# Altium schematic sheet HDMI.SchDoc: HDMI Interface
size A4
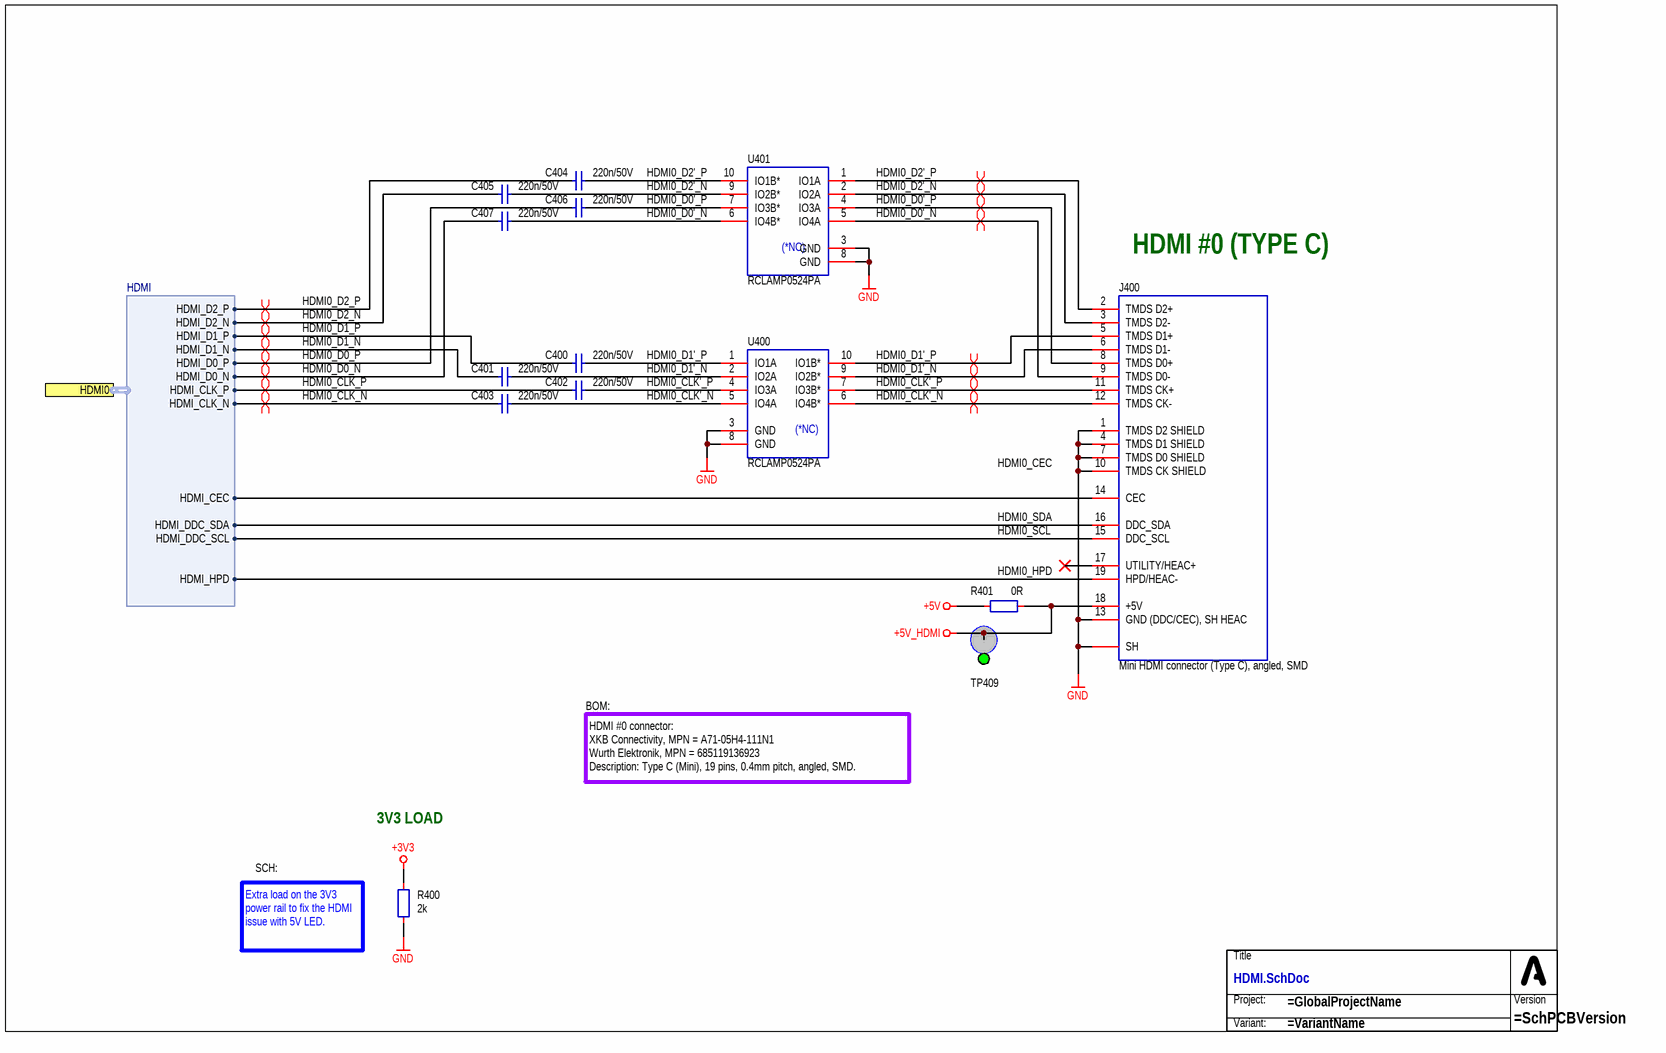
[diagram p0: HDMI.SchDoc]

## Parts
C400  220n/50V  [CAP_0402_R]
C401  220n/50V  [CAP_0402_R]
C402  220n/50V  [CAP_0402_R]
C403  220n/50V  [CAP_0402_R]
C404  220n/50V  [CAP_0402_R]
C405  220n/50V  [CAP_0402_R]
C406  220n/50V  [CAP_0402_R]
C407  220n/50V  [CAP_0402_R]
J400  Mini HDMI connector (Type C), angled, SMD  [CON_XKB_A71-05H4-1X1N1]
R400  2k  [RES_0603_R]
R401  0R  [RES_0603_R]
TB400  (no value)  (no BOM)
TP409  ICT  [PCB_TP_ICT_100]  (value not drawn)  (no BOM)
U400  RCLAMP0524PA  [ICC_SLP2510P8_250X100X60_P50_R]
U401  RCLAMP0524PA  [ICC_SLP2510P8_250X100X60_P50_R]

## Ports
HDMI0 (harness HDMI)

## Harnesses
HDMI: HDMI_D0_P, HDMI_D0_N, HDMI_D1_P, HDMI_D1_N, HDMI_CEC, HDMI_DDC_SDA, HDMI_D2_P, HDMI_D2_N, HDMI_CLK_P, HDMI_CLK_N, HDMI_DDC_SCL, HDMI_HPD

## Nets
+3V3: R400.2
+5V: R401.2
+5V_HDMI: J400.18(+5V) R401.1 TP409.1
GND: J400.1(TMDS_D2_SHIELD) J400.4(TMDS_D1_SHIELD) J400.7(TMDS_D0_SHIELD) J400.10(TMDS_CK_SHIELD) J400.13(GND_(DDC/CEC),_SH_HEAC) J400.SH R400.1 U400.3(GND) U400.8(GND) U401.3(GND) U401.8(GND)
HDMI0_CLK'_N: C403.2 J400.12(TMDS_CK-) U400.5(IO4A) U400.6(IO4B*)
HDMI0_CLK'_P: C402.2 J400.11(TMDS_CK+) U400.4(IO3A) U400.7(IO3B*)
HDMI0_CLK_N: C403.1 ; port HDMI0.HDMI_CLK_N
HDMI0_CLK_P: C402.1 ; port HDMI0.HDMI_CLK_P
HDMI0_D0'_N: C407.2 J400.9(TMDS_D0-) U401.5(IO4A) U401.6(IO4B*)
HDMI0_D0'_P: C406.2 J400.8(TMDS_D0+) U401.4(IO3A) U401.7(IO3B*)
HDMI0_D0_N: C407.1 ; port HDMI0.HDMI_D0_N
HDMI0_D0_P: C406.1 ; port HDMI0.HDMI_D0_P
HDMI0_D1'_N: C401.2 J400.6(TMDS_D1-) U400.2(IO2A) U400.9(IO2B*)
HDMI0_D1'_P: C400.2 J400.5(TMDS_D1+) U400.1(IO1A) U400.10(IO1B*)
HDMI0_D1_N: C401.1 ; port HDMI0.HDMI_D1_N
HDMI0_D1_P: C400.1 ; port HDMI0.HDMI_D1_P
HDMI0_D2'_N: C405.2 J400.3(TMDS_D2-) U401.2(IO2A) U401.9(IO2B*)
HDMI0_D2'_P: C404.2 J400.2(TMDS_D2+) U401.1(IO1A) U401.10(IO1B*)
HDMI0_D2_N: C405.1 ; port HDMI0.HDMI_D2_N
HDMI0_D2_P: C404.1 ; port HDMI0.HDMI_D2_P
HDMI0_HPD: J400.19(HPD/HEAC-) ; port HDMI0.HDMI_HPD
HDMI0_SCL: J400.15(DDC_SCL) ; port HDMI0.HDMI_DDC_SCL
HDMI0_SDA: J400.16(DDC_SDA) ; port HDMI0.HDMI_DDC_SDA
NetJ400_14: J400.14(CEC) ; port HDMI0.HDMI_CEC

Not connected (* = marked no-connect by the designer): J400 17(UTILITY/HEAC+)*

## Layout directives
differential pair: HDMI0_CLK'_N, HDMI0_CLK'_P, HDMI0_CLK_N, HDMI0_CLK_P, HDMI0_D0'_N, HDMI0_D0'_P, HDMI0_D0_N, HDMI0_D0_P, HDMI0_D1'_N, HDMI0_D1'_P, HDMI0_D1_N, HDMI0_D1_P, HDMI0_D2'_N, HDMI0_D2'_P, HDMI0_D2_N, HDMI0_D2_P

## Notes on the sheet
- (near J400) HDMI #0 (TYPE C)
- BOM:
- HDMI #0 connector:
  XKB Connectivity, MPN = A71-05H4-111N1
  Wurth Elektronik, MPN = 685119136923
  Description: Type C (Mini), 19 pins, 0.4mm pitch, angled, SMD.
- 3V3 LOAD
- SCH:
- (near R400) Extra load on the 3V3 power rail to fix the HDMI issue with 5V LED.
- Labels drawn without touching a wire or pin: HDMI0_CEC
- (in symbol ICC-0005) (*NC)
- (in symbol SCH_TITLE_BLOCK_SIMPLE_NODATE) Title; Project:; Version; Variant:

## Library data of the parts
C400-C407 = ITEM_C10044: CAP SMD 220n/50V ±10% 50V X5R (0402); Manufacturer: Murata Electronics; MPN: GRM155R61H224KE01D; Component Subtype: MLCC; Package (Case): 0402; Value: 220nF; Component Type: Capacitor; Mounting Type: SMD
J400 = CON_HDMI_1.4+_MINI_TYPE_C_A1: Connector; HDMI v1.4+; Type C (Mini-HDMI);; Manufacturer: XKB Connectivity; MPN: A71-05H4-111N1; Component Subtype: Mini HDMI (Type C); Component Type: Connector; Mounting Type: SMD; Package (Case): SMD; Value: Mini HDMI connector (Type C), angled, SMD
R400 = RES-0033: Resistor; Thick Film; 2k2; 1%; 100mW; 100PPM; 75V; Standard; SMD; 0603 (1608);; Manufacturer: UNI-ROYAL(Uniroyal Elec); MPN: 0603WAF2001T5E; Package (Case): 0603; Component Type: Resistor; Component Subtype: Thick Film; Value: 2k; Mounting Type: SMD
R401 = RES-0054: Resistor; Thick Film; 0R; SMD; 0603 (1608);; Manufacturer: UNI-ROYAL(Uniroyal Elec); MPN: 0603WAF0000T5E; Package (Case): 0603; Component Type: Resistor; Component Subtype: Thick Film; Value: 0R; Mounting Type: SMD
TB400 = SCH_TITLE_BLOCK_SIMPLE_NODATE
TP409 = PCB_TP_ICT: Test Point (ICT); Component Type: Testpoint (for ICT); Mounting Type: Non component; Value: ICT
U400 U401 = ICC-0005: IC; TVS Arrays; ESD Protection; 4-Channel; 17kV Air; 12kV Contact; 0.3pF Capitance; TBD; SMD; TBD;; Manufacturer: Semtech Corporation; MPN: RCLAMP0524PATCT; Package (Case): DFN-10(1x2.5); Component Type: IC; Component Subtype: TVS Arrays; Value: RCLAMP0524PA; Mounting Type: SMD